# EAGLE design Tiny-RC-Serial (EAGLE 6.3)
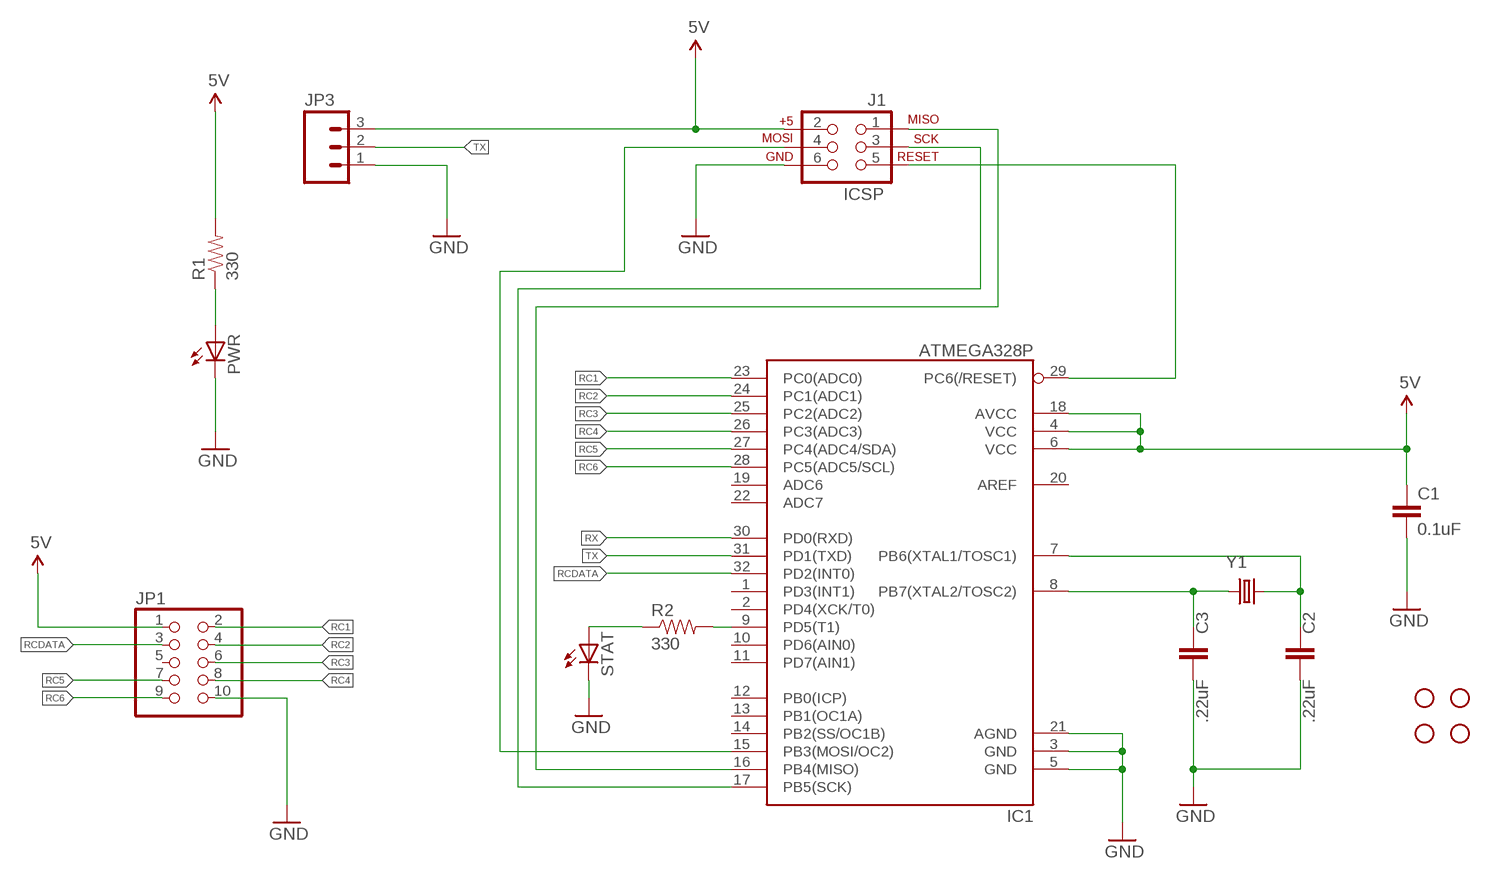
[diagram p0: schematic, sheet 1]

## Parts
C1  0.1uF  CAPKIT  [CAP-PTH-SMALL-KIT]
C2  .22uF  CAPKIT  [CAP-PTH-SMALL-KIT]
C3  .22uF  CAPKIT  [CAP-PTH-SMALL-KIT]
IC1  ATMEGA328P  ATMEGA328_SMT  [TQFP32-08]
J1  ICSP  AVR_SPI_PRG_6PTH  [2X3]
JP1  PINHD-2X5  [2X05]
JP3  M03PTH  [1X03]
PWR  LED1206  [LED-1206]
R1  330  RESISTOR1206  [1206]
R2  330  RESISTOR1206  [1206]
S1  STAND-OFFTIGHT  [STAND-OFF-TIGHT]
S2  STAND-OFFTIGHT  [STAND-OFF-TIGHT]
S3  STAND-OFFTIGHT  [STAND-OFF-TIGHT]
S4  STAND-OFFTIGHT  [STAND-OFF-TIGHT]
STAT  LED1206  [LED-1206]
Y1  20Mhz  CRYSTALHC49US  [HC49US]

## Nets
5V: C1.1 IC1.4(VCC) IC1.6(VCC) IC1.18(AVCC) J1.2 JP1.1 JP3.3 R1.2
GND: C1.2 C2.2 C3.2 IC1.3(GND) IC1.5(GND) IC1.21(AGND) J1.6 JP1.10 JP3.1 PWR.C STAT.C
MISO: IC1.16(PB4(MISO)) J1.1
MOSI: IC1.15(PB3(MOSI/OC2)) J1.4
N$1: IC1.9(PD5(T1)) R2.2
N$2: PWR.A R1.1
N$3: C2.1 IC1.7(PB6(XTAL1/TOSC1)) Y1.2
N$4: C3.1 IC1.8(PB7(XTAL2/TOSC2)) Y1.1
N$5: R2.1 STAT.A
RC1: IC1.23(PC0(ADC0)) JP1.2
RC2: IC1.24(PC1(ADC1)) JP1.4
RC3: IC1.25(PC2(ADC2)) JP1.6
RC4: IC1.26(PC3(ADC3)) JP1.8
RC5: IC1.27(PC4(ADC4/SDA)) JP1.7
RC6: IC1.28(PC5(ADC5/SCL)) JP1.9
RCDATA: IC1.32(PD2(INT0)) JP1.3
RESET: IC1.29(PC6(/RESET)) J1.5
RX: IC1.30(PD0(RXD))
SCK: IC1.17(PB5(SCK)) J1.3
TX: IC1.31(PD1(TXD)) JP3.2
Unconnected: IC1.1(PD3(INT1)) IC1.2(PD4(XCK/T0)) IC1.10(PD6(AIN0)) IC1.11(PD7(AIN1)) IC1.12(PB0(ICP)) IC1.13(PB1(OC1A)) IC1.14(PB2(SS/OC1B)) IC1.19(ADC6) IC1.20(AREF) IC1.22(ADC7) JP1.5

## Library data of the parts
C1-C3 = SparkFun-Capacitors:CAP: Capacitor Standard 0603 ceramic capacitor, and 0.1" leaded capacitor.
IC1 = SparkFun-DigitalIC:ATMEGA328_SMT: 32-Pin Atmega328 part Commonly used on Arduino compatible boards Available in QFP and QFN packages TQFP is IC-09069 QFN is non-stock; PROD_ID: IC-09069
J1 = SparkFun-Connectors:AVR_SPI_PRG_6: AVR ISP 6 Pin This is the reduced ISP connector for AVR programming. Common on Arduino. This footprint will take up less PCB space and can be used with a 10-pin to 6-pin adapter such as SKU: BOB-08508
JP1 = pinhead:PINHD-2X5: PIN HEADER
JP3 = SparkFun-Connectors:M03: Header 3 Standard 3-pin 0.1" header. Use with straight break away headers (SKU : PRT-00116), right angle break away headers (PRT-00553), swiss pins (PRT-00743), machine pins (PRT-00117), and female headers (PRT-00115). Molex polarized connector foot print use with SKU : PRT-08232 with associated crimp pins and housings.
PWR STAT = SparkFun-LED:LED: LEDs Standard schematic elements and footprints for 5mm, 3mm, 1206, and 0603 sized LEDs. 5mm - Spark Fun Electronics SKU : COM-00529 (and others)
R1 R2 = SparkFun-Resistors:RESISTOR: Resistor Basic schematic elements and footprints for 0603, 1206, and PTH resistors.
S1-S4 = SparkFun:STAND-OFF: Stand Off This is the mechanical footprint for a #4 phillips button head screw. Use the keepout ring to avoid running the screw head into surrounding components. SKU : PRT-00447
Y1 = SparkFun-FreqCtrl:CRYSTAL: Various standard crystals. Proven footprints. Spark Fun Electronics SKU : COM-00534

## Board
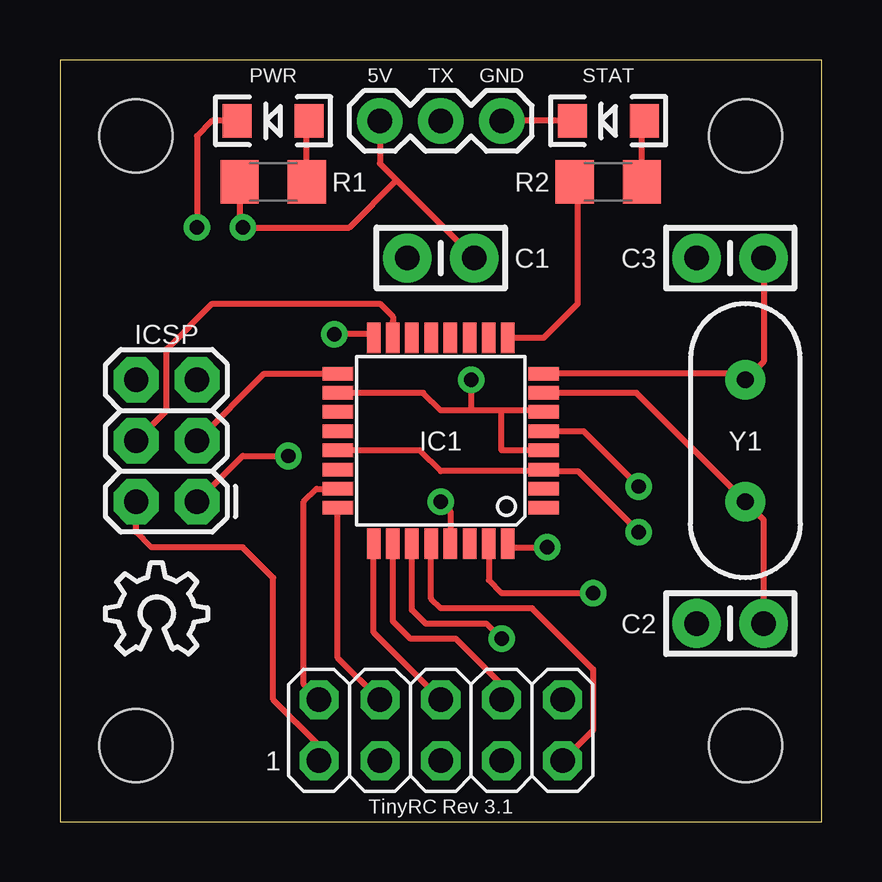
[diagram p1: board, top side]
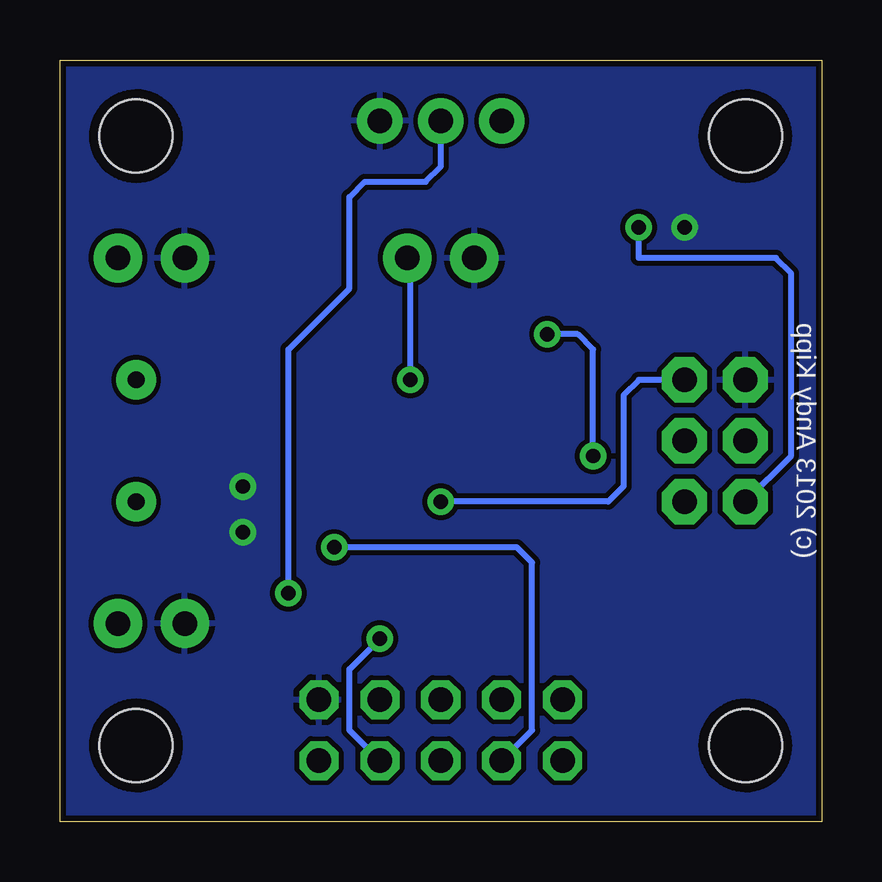
[diagram p2: board, bottom side, seen from below]

Size 31.75 x 31.75 mm. Coordinates in mm from the lower left corner, seen from the top.
Outline: 0,0 31.75,0 31.75,31.75 0,31.75 0,0
Copper layers (1*16): Top 0.035mm / dielectric 1.5mm / Bottom 0.035mm
Design rules "SparkFun": minimum track width 8mil, minimum drill 20mil, track to track 8mil, track to pad 8mil, pad to pad 8mil, via to via 8mil, smd to smd 8mil, copper to edge 10mil, drill to drill 8mil, minimum pad ring 12mil, minimum via ring 10mil, stop-mask expansion 4mil, vias tented up to drill 25mil, thermal gap 10mil

### Footprints (pad centres in the part's own frame; a part is rotated, then mirrored left to right if it is on the bottom)
CAP-PTH-SMALL-KIT = drill 1.016 pad 2.032: 1 -1.397,0; 2 1.397,0
TQFP32-08 = smd 1.27 x 0.559: 1 -4.293,2.8; 2 -4.293,2; 3 -4.293,1.2; 4 -4.293,0.4; 5 -4.293,-0.4; 6 -4.293,-1.2; 7 -4.293,-2; 8 -4.293,-2.8; 17 4.293,-2.8; 18 4.293,-2; 19 4.293,-1.2; 20 4.293,-0.4; 21 4.293,0.4; 22 4.293,1.2; 23 4.293,2; 24 4.293,2.8 | smd 0.559 x 1.27: 9 -2.8,-4.293; 10 -2,-4.293; 11 -1.2,-4.293; 12 -0.4,-4.293; 13 0.4,-4.293; 14 1.2,-4.293; 15 2,-4.293; 16 2.8,-4.293; 25 2.8,4.293; 26 2,4.293; 27 1.2,4.293; 28 0.4,4.293; 29 -0.4,4.293; 30 -1.2,4.293; 31 -2,4.293; 32 -2.8,4.293
2X3 = drill 1.016 pad 1.88 octagon: 1 0,0; 2 0,2.54; 3 2.54,0; 4 2.54,2.54; 5 5.08,0; 6 5.08,2.54
2X05 = drill 1.016 octagon: 1 -5.08,-1.27; 2 -5.08,1.27; 3 -2.54,-1.27; 4 -2.54,1.27; 5 0,-1.27; 6 0,1.27; 7 2.54,-1.27; 8 2.54,1.27; 9 5.08,-1.27; 10 5.08,1.27
1X03 = drill 1.016 pad 1.88: 1 0,0; 2 2.54,0; 3 5.08,0
LED-1206 = smd 1.2 x 1.4: A -1.5,0; C 1.5,0
1206 = smd 1.6 x 1.8: 1 -1.4,0; 2 1.4,0
STAND-OFF-TIGHT = hole 3.048: 0,0
HC49US = drill 0.7 pad 1.651: 1 -2.54,0; 2 2.54,0

### Placement (x,y rotation side)
C1  15.88,23.5 180 top
C2  27.94,8.26 180 top
C3  27.94,23.5 180 top
IC1  15.88,15.88 180 top
J1  5.71,13.34 90 top
JP1  15.88,3.81 0 top
JP3  18.41,29.21 180 top
PWR  8.89,29.21 180 top
R1  8.89,26.67 180 top
R2  22.86,26.67 180 top
S1  3.17,3.17 0 top
S2  28.57,28.57 0 top
S3  28.57,3.17 0 top
S4  3.17,28.57 0 top
STAT  22.86,29.21 180 top
U$5  [OSHW_8X150_NOTEXT]  1.91,6.99 0 top
Y1  28.57,15.88 270 top

### Tracks (layer width: path | path; a pad name or v marks a point on that pad's centre or on a via)
5V  (via drill 0.6)
  Top 0.254: IC1.6 20.1,17.14 18.41,17.14 | 18.41,17.14 17.14,17.14 | 17.14,17.14 15.88,17.14 15.14,17.88 IC1.18 11.49,17.78 | IC1.4 18.41,15.47 18.41,17.14 | v17.14,18.41 17.14,17.14 | JP3.3 13.34,27.43 14.03,26.73 | 14.03,26.73 C1.1 | R1.2 7.49,24.89 v7.62,24.77 12.06,24.77 14.03,26.73 | JP1.1 10.79,3.17 8.89,5.08 8.89,10.16 7.62,11.43 3.81,11.43 3.17,12.06 J1.2
  Bottom 0.254: v17.14,18.41 17.14,23.37 C1.1 | J1.2 1.27,15.24 1.27,22.86 1.91,23.5 7.62,23.5 v7.62,24.77
GND  (via drill 0.6)
  Top 0.254: STAT.C JP3.1 | PWR.C 6.35,29.21 5.71,28.57 v5.71,24.77 | IC1.5 21.82,16.27 v24.13,13.97 | v24.13,12.06 21.59,14.61 20.24,14.61 IC1.3 20.1,14.61 15.88,14.61 15.01,15.47 IC1.21
  pour Bottom: -1.27,33.02 -1.27,-1.27 33.02,-1.27 33.02,33.02
MISO  (via drill 0.6)
  Top 0.254: IC1.16 12.92,20.32 v11.43,20.32 | J1.1 7.62,15.24 v9.53,15.24
  Bottom 0.254: v9.53,15.24 9.53,19.68 10.16,20.32 v11.43,20.32
MOSI
  Top 0.254: 13.88,20.86 IC1.15 13.88,21.05 13.34,21.59 10.79,21.59 10.16,21.59 6.35,21.59 4.45,19.68 4.45,17.14 J1.4
N$1
  Top 0.254: IC1.9 20.17,20.17 21.59,21.59 21.59,26.54 R2.2
N$2
  Top 0.254: R1.1 10.29,29.11 PWR.A
N$3
  Top 0.254: IC1.7 24.04,17.88 Y1.2 29.34,12.57 C2.1
N$4
  Top 0.254: IC1.8 28.32,18.68 Y1.1 29.34,19.18 C3.1
N$5
  Top 0.254: R2.1 24.26,29.11 STAT.A
RC1
  Top 0.254: JP1.2 10.16,5.71 10.16,13.34 10.7,13.88 IC1.23
RC2
  Top 0.254: JP1.4 11.58,6.83 IC1.24
RC3
  Top 0.254: JP1.6 13.07,7.88 IC1.25
RC4
  Top 0.254: IC1.26 13.88,8.35 14.61,7.62 16.51,7.62 18.41,5.71 JP1.8
RC5  (via drill 0.6)
  Top 0.254: IC1.27 14.68,8.82 15.24,8.26 17.78,8.26 v18.41,7.62
  Bottom 0.254: JP1.7 19.68,3.81 19.68,6.35 v18.41,7.62
RC6
  Top 0.254: IC1.28 15.47,9.29 15.88,8.89 19.68,8.89 22.23,6.35 22.23,3.81 JP1.9
RCDATA  (via drill 0.6)
  Top 0.254: IC1.32 18.83,11.43 v20.32,11.43
  Bottom 0.254: JP1.3 12.06,3.81 12.06,10.79 12.7,11.43 v20.32,11.43
RESET  (via drill 0.6)
  Top 0.254: v15.88,13.34 16.27,12.94 IC1.29
  Bottom 0.254: J1.5 7.62,18.41 8.26,17.78 8.26,13.97 8.89,13.34 v15.88,13.34
SCK
  Top 0.254: IC1.17 8.89,18.68 8.52,18.68 J1.3
TX  (via drill 0.6)
  Top 0.254: IC1.31 17.88,10.06 18.41,9.53 v22.23,9.53
  Bottom 0.254: JP3.2 15.88,27.3 16.51,26.67 19.05,26.67 19.68,26.04 19.68,22.23 22.23,19.68 v22.23,9.53

### Text on the board
tNames: R1
_tsilk: 5V | TX | GND | 1 | TinyRC Rev 3.1
_bsilk: (c) 2013 Andy Kipp